# Altium schematic sheet midi.SchDoc
size Letter
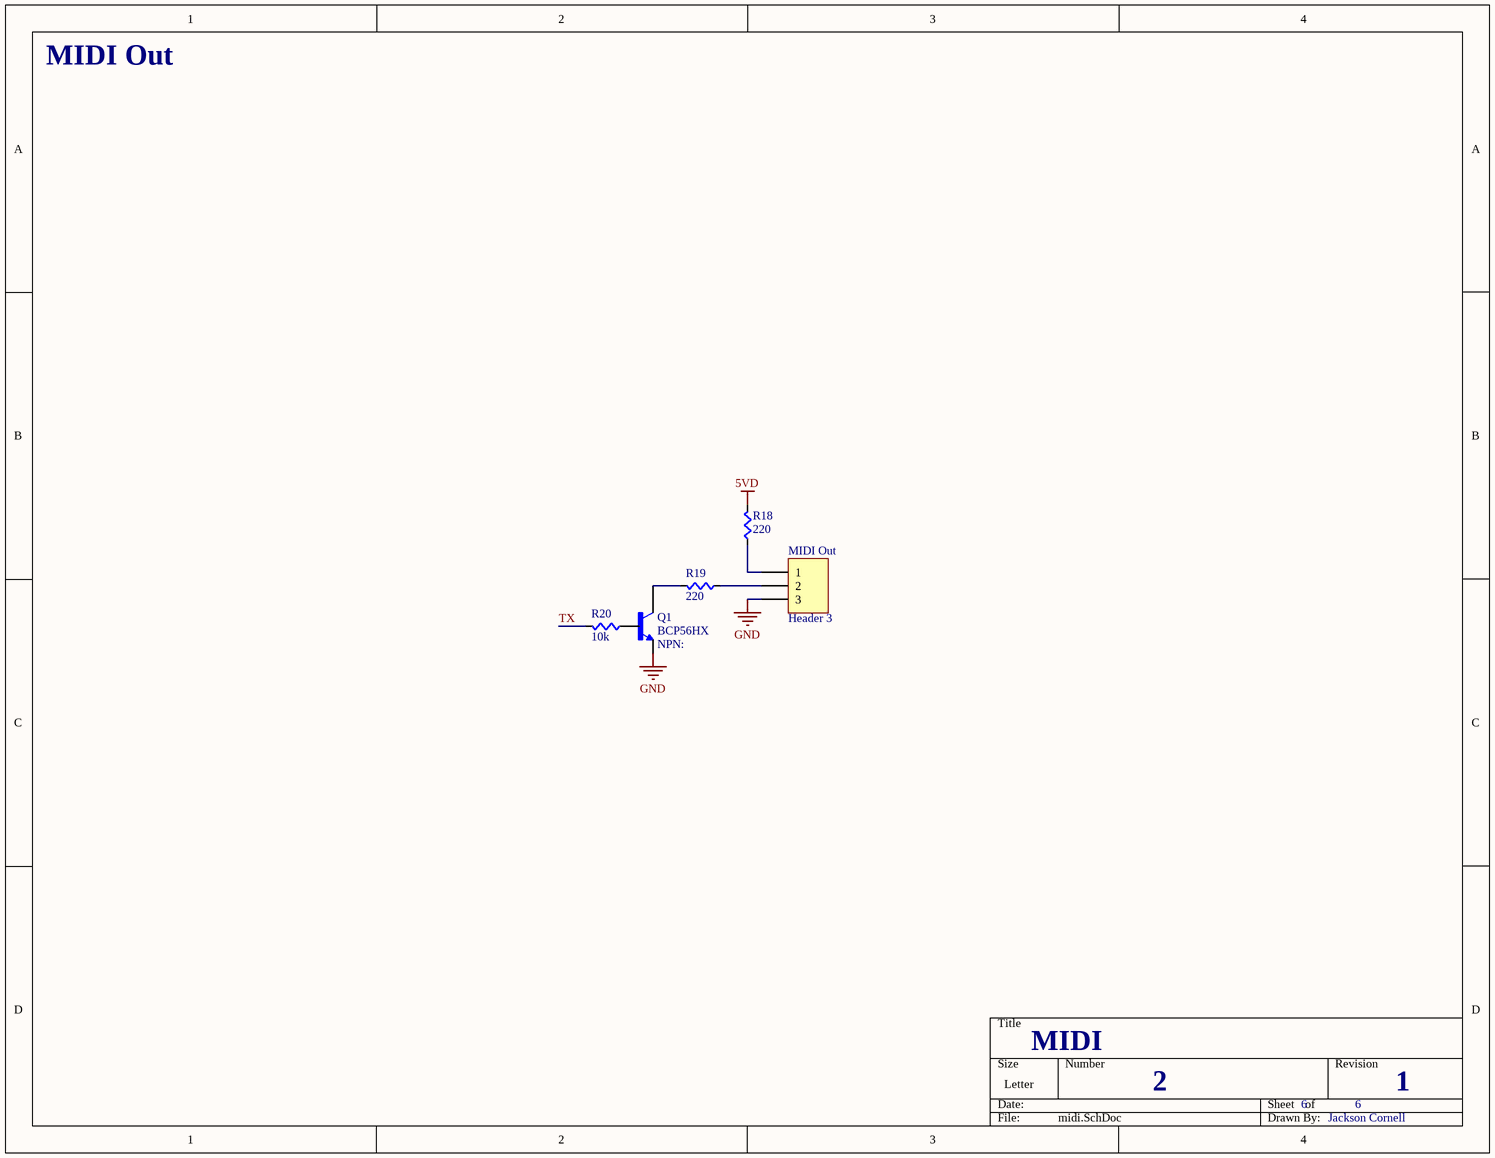
[diagram p0: midi.SchDoc]

## Parts
MIDI_Out  Header 3  [HDR1X3]
Q1  BCP56HX  [SOT-223]
R18  value 220  [RES0805]  (hidden comment: Res)
R19  value 220  [RES0805]  (hidden comment: Res)
R20  value 10k  [RES0805]  (hidden comment: Res)

## Nets
5VD: R18.1(A)
GND: MIDI_Out.3 Q1.3(E)
TX: R20.1(A)
NetMIDI_Out_1: MIDI_Out.1 R18.2(B)
NetMIDI_Out_2: MIDI_Out.2 R19.2(B)
NetQ1_1: Q1.1(B) R20.2(B)
NetQ1_4: Q1.4(C2) R19.1(A)

Not connected (* = marked no-connect by the designer): Q1 2(C1)

## Notes on the sheet
- MIDI Out
- MIDI
- 2
- 6
- 1
- Jackson Cornell

## Library data of the parts
MIDI_Out = Header 3: Header, 3-Pin; LatestRevisionDate: 17-Jul-2002; LatestRevisionNote: Re-released for DXP Platform.; Publisher: Altium Limited
Q1 = STN2580: Bipolar (BJT) Transistor NPN 400V 1A 1.6W Surface Mount SOT-223; MF: STMicroelectronics; Package: SOT-223 STMicroelectronics; MP: STN2580; Value: *; SnapEDA_Link: https://www.snapeda.com/parts/STN2580/STMicroelectronics/view-part/815004/?ref=snap; Price: None; Availability: Unavailable
R18-R20 = Res: Supplier 1: Digi-Key; Supplier Part Number 1: RMCF0603JT10K0CT-ND